# Altium project 60%KeyBord.PrjPcb
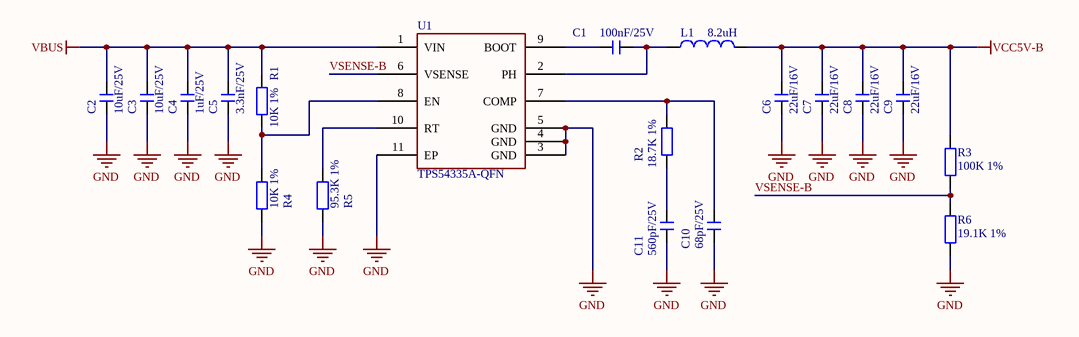
[diagram p0: PWR.SchDoc]
3 sheets, 90 parts. Net scope: global (net labels, ports and power ports of the same name join across sheets).
Board file: PCB.PcbDoc
Sheets:
  PWR.SchDoc
  mcu.SchDoc
  Connector.SchDoc

## Sheet PWR.SchDoc
size A4; SheetNumber: 1; SheetTotal: 3

### Parts
C1  100nF/25V  [C0402_L]
C2  10uF/25V  [C0603_L]
C3  10uF/25V  [C0603_L]
C4  1uF/25V  [C0603_L]
C5  3.3nF/25V  [C0603_L]
C6  22uF/16V  [C0603_L]
C7  22uF/16V  [C0603_L]
C8  22uF/16V  [C0603_L]
C9  22uF/16V  [C0603_L]
C10  68pF/25V  [C0402_L]
C11  560pF/25V  [C0402_L]
L1  8.2uH  [NR4020]
R1  10K 1%  [R0402_L]
R2  18.7K 1%  [R0402_L]
R3  100K 1%  [R0402_L]
R4  10K 1%  [R0402_L]
R5  95.3K 1%  [R0402_L]
R6  19.1K 1%  [R0402_L]
U1  TPS54335A-QFN  [VSON-10_L3.0-W3.0-P0.50-TL-EP]

### Nets
GND: C2.1 C3.1 C4.1 C5.1 C6.1 C7.1 C8.1 C9.1 C10.1 C11.1 R4.2 R5.2 R6.2 U1.3(GND) U1.4(GND) U1.5(GND) U1.11(EP)
VBUS: C2.2 C3.2 C4.2 C5.2 R1.1 U1.1(VIN)
VCC5V-B: C6.2 C7.2 C8.2 C9.2 L1.2 R3.1
VSENSE-B: R3.2 R6.1 U1.6(VSENSE)
NetC1_1: C1.1 L1.1 U1.2(PH)
NetC1_2: C1.2 U1.9(BOOT)
NetC10_2: C10.2 R2.1 U1.7(COMP)
NetC11_2: C11.2 R2.2
NetR1_2: R1.2 R4.1 U1.8(EN)
NetR5_1: R5.1 U1.10(RT)

### Library data of the parts
C1-C11 = C: 无极性贴片电容; 版权归属: 源创客; 材质: X7R; BOM名称: 无极性贴片电容; 学习资源: www.ooocke.com
L1 = L: 小功率贴片电感; 版权归属: 源创客; BOM名称: 小功率贴片电感; 学习资源: www.ooocke.com
R1-R6 = R: 贴片电阻; 版权归属: 源创客; BOM名称: 贴片电阻; 学习资源: www.ooocke.com
U1 = TPS54335A-QFN: BUCK

## Sheet mcu.SchDoc
size A4; SheetNumber: 2; SheetTotal: 3
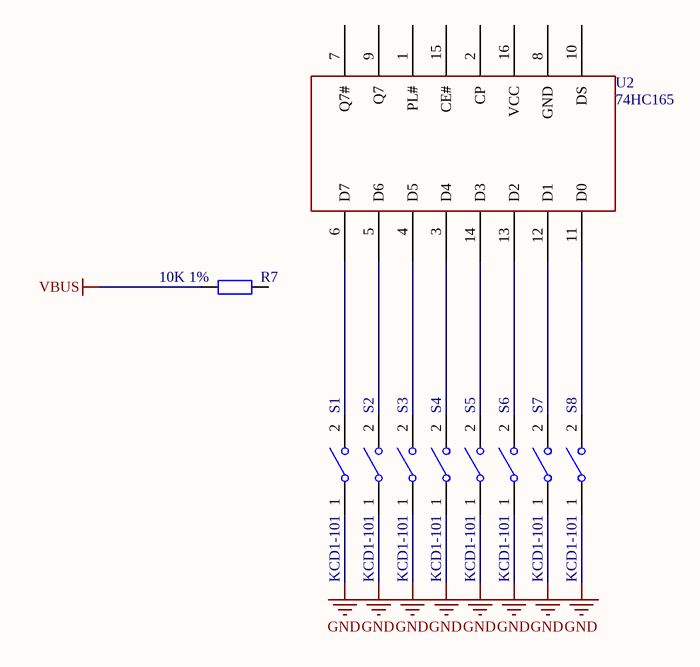
[diagram p1: mcu.SchDoc]

### Parts
R7  10K 1%  [R0402_L]
S1  KCD1-101  [KCD1-101]
S2  KCD1-101  [KCD1-101]
S3  KCD1-101  [KCD1-101]
S4  KCD1-101  [KCD1-101]
S5  KCD1-101  [KCD1-101]
S6  KCD1-101  [KCD1-101]
S7  KCD1-101  [KCD1-101]
S8  KCD1-101  [KCD1-101]
U2  74HC165  [SOP16_L]

### Nets
GND: S1.1 S2.1 S3.1 S4.1 S5.1 S6.1 S7.1 S8.1
VBUS: R7.1
NetS1_2: S1.2 U2.6(D7)
NetS2_2: S2.2 U2.5(D6)
NetS3_2: S3.2 U2.4(D5)
NetS4_2: S4.2 U2.3(D4)
NetS5_2: S5.2 U2.14(D3)
NetS6_2: S6.2 U2.13(D2)
NetS7_2: S7.2 U2.12(D1)
NetS8_2: S8.2 U2.11(D0)

Not connected (* = marked no-connect by the designer): R7 2; U2 1(PL#) 2(CP) 7(Q7#) 8(GND) 9(Q7) 10(DS) 15(CE#) 16(VCC)

### Library data of the parts
R7 = R: 贴片电阻; 版权归属: 源创客; BOM名称: 贴片电阻; 学习资源: www.ooocke.com
S1-S8 = KCD1-101: 1路单刀船型开关; 版权归属: 源创客; BOM名称: 1路单刀船型开关; 学习资源: www.ooocke.com
U2 = 74HC165: 移位寄存器

## Sheet Connector.SchDoc
size A4; SheetNumber: 3; SheetTotal: 3
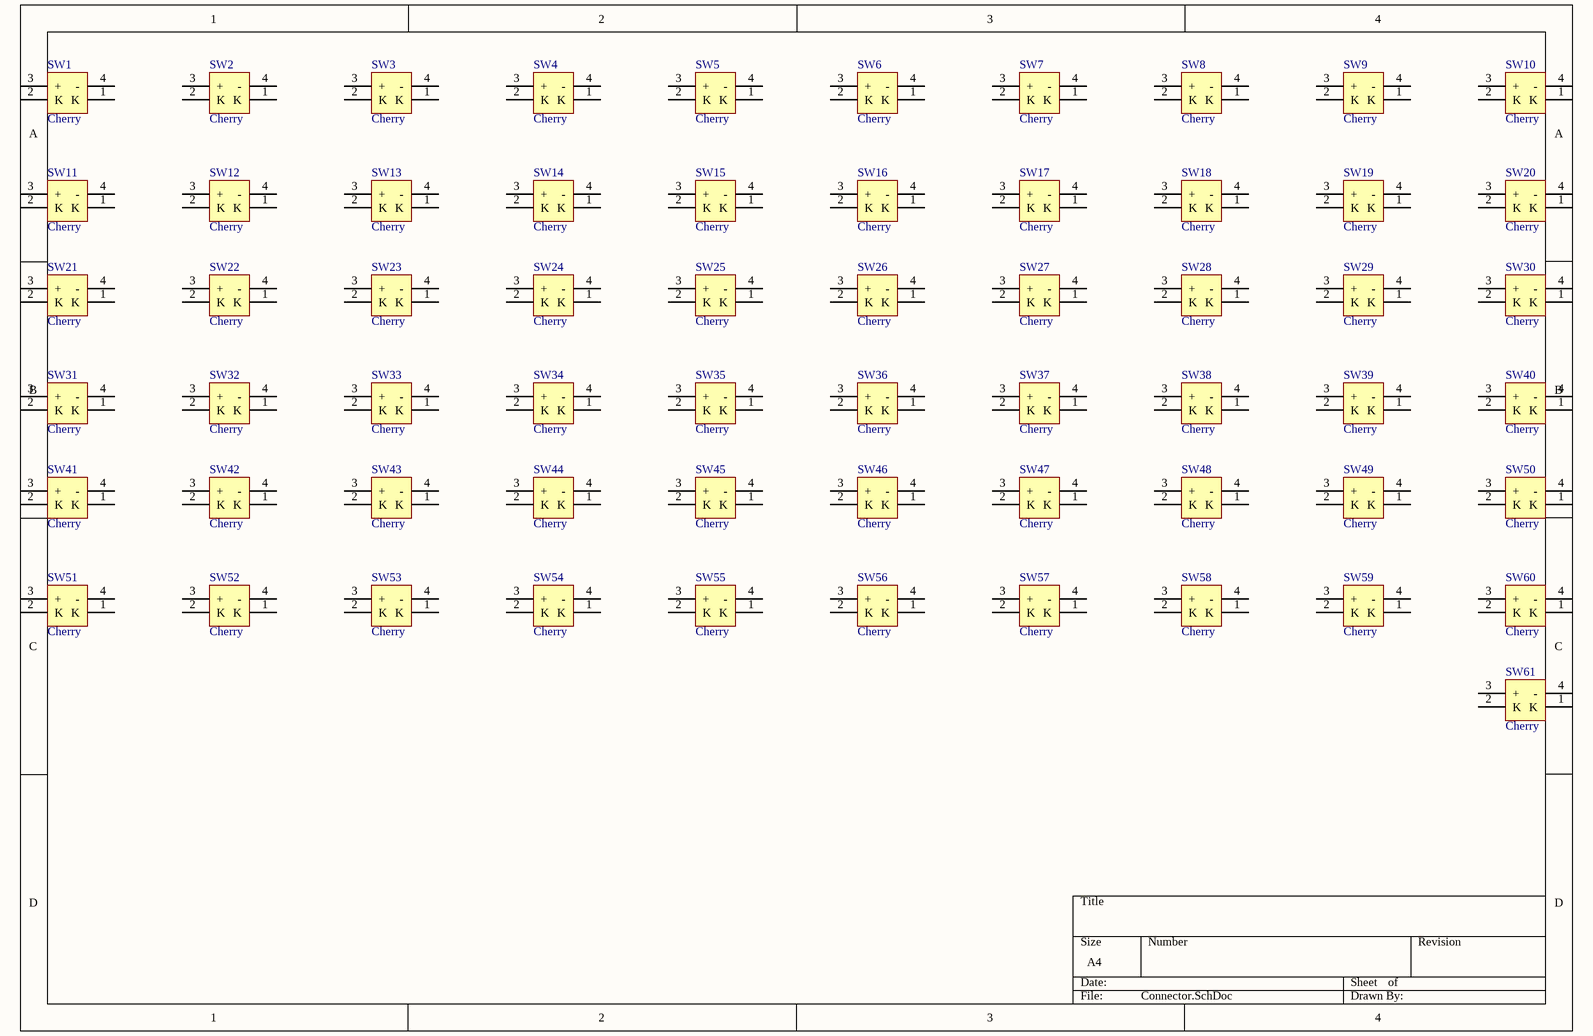
[diagram p2: Connector.SchDoc]

### Parts
SW1  Cherry  [SW_Cherry_MX_WS2812]
SW2  Cherry  [SW_Cherry_MX_WS2812]
SW3  Cherry  [SW_Cherry_MX_WS2812]
SW4  Cherry  [SW_Cherry_MX_WS2812]
SW5  Cherry  [SW_Cherry_MX_WS2812]
SW6  Cherry  [SW_Cherry_MX_WS2812]
SW7  Cherry  [SW_Cherry_MX_WS2812]
SW8  Cherry  [SW_Cherry_MX_WS2812]
SW9  Cherry  [SW_Cherry_MX_WS2812]
SW10  Cherry  [SW_Cherry_MX_WS2812]
SW11  Cherry  [SW_Cherry_MX_WS2812]
SW12  Cherry  [SW_Cherry_MX_WS2812]
SW13  Cherry  [SW_Cherry_MX_WS2812]
SW14  Cherry  [SW_Cherry_MX_WS2812]
SW15  Cherry  [SW_Cherry_MX_WS2812]
SW16  Cherry  [SW_Cherry_MX_WS2812]
SW17  Cherry  [SW_Cherry_MX_WS2812]
SW18  Cherry  [SW_Cherry_MX_WS2812]
SW19  Cherry  [SW_Cherry_MX_WS2812]
SW20  Cherry  [SW_Cherry_MX_WS2812]
SW21  Cherry  [SW_Cherry_MX_WS2812]
SW22  Cherry  [SW_Cherry_MX_WS2812]
SW23  Cherry  [SW_Cherry_MX_WS2812]
SW24  Cherry  [SW_Cherry_MX_WS2812]
SW25  Cherry  [SW_Cherry_MX_WS2812]
SW26  Cherry  [SW_Cherry_MX_WS2812]
SW27  Cherry  [SW_Cherry_MX_WS2812]
SW28  Cherry  [SW_Cherry_MX_WS2812]
SW29  Cherry  [SW_Cherry_MX_WS2812]
SW30  Cherry  [SW_Cherry_MX_WS2812]
SW31  Cherry  [SW_Cherry_MX_WS2812]
SW32  Cherry  [SW_Cherry_MX_WS2812]
SW33  Cherry  [SW_Cherry_MX_WS2812]
SW34  Cherry  [SW_Cherry_MX_WS2812]
SW35  Cherry  [SW_Cherry_MX_WS2812]
SW36  Cherry  [SW_Cherry_MX_WS2812]
SW37  Cherry  [SW_Cherry_MX_WS2812]
SW38  Cherry  [SW_Cherry_MX_WS2812]
SW39  Cherry  [SW_Cherry_MX_WS2812]
SW40  Cherry  [SW_Cherry_MX_WS2812]
SW41  Cherry  [SW_Cherry_MX_WS2812]
SW42  Cherry  [SW_Cherry_MX_WS2812]
SW43  Cherry  [SW_Cherry_MX_WS2812]
SW44  Cherry  [SW_Cherry_MX_WS2812]
SW45  Cherry  [SW_Cherry_MX_WS2812]
SW46  Cherry  [SW_Cherry_MX_WS2812]
SW47  Cherry  [SW_Cherry_MX_WS2812]
SW48  Cherry  [SW_Cherry_MX_WS2812]
SW49  Cherry  [SW_Cherry_MX_WS2812]
SW50  Cherry  [SW_Cherry_MX_WS2812]
SW51  Cherry  [SW_Cherry_MX_WS2812]
SW52  Cherry  [SW_Cherry_MX_WS2812]
SW53  Cherry  [SW_Cherry_MX_WS2812]
SW54  Cherry  [SW_Cherry_MX_WS2812]
SW55  Cherry  [SW_Cherry_MX_WS2812]
SW56  Cherry  [SW_Cherry_MX_WS2812]
SW57  Cherry  [SW_Cherry_MX_WS2812]
SW58  Cherry  [SW_Cherry_MX_WS2812]
SW59  Cherry  [SW_Cherry_MX_WS2812]
SW60  Cherry  [SW_Cherry_MX_WS2812]
SW61  Cherry  [SW_Cherry_MX_WS2812]

### Nets

Not connected (* = marked no-connect by the designer): SW1 1(K) 2(K) 3(+) 4(-); SW2 1(K) 2(K) 3(+) 4(-); SW3 1(K) 2(K) 3(+) 4(-); SW4 1(K) 2(K) 3(+) 4(-); SW5 1(K) 2(K) 3(+) 4(-); SW6 1(K) 2(K) 3(+) 4(-); SW7 1(K) 2(K) 3(+) 4(-); SW8 1(K) 2(K) 3(+) 4(-); SW9 1(K) 2(K) 3(+) 4(-); SW10 1(K) 2(K) 3(+) 4(-); SW11 1(K) 2(K) 3(+) 4(-); SW12 1(K) 2(K) 3(+) 4(-); SW13 1(K) 2(K) 3(+) 4(-); SW14 1(K) 2(K) 3(+) 4(-); SW15 1(K) 2(K) 3(+) 4(-); SW16 1(K) 2(K) 3(+) 4(-); SW17 1(K) 2(K) 3(+) 4(-); SW18 1(K) 2(K) 3(+) 4(-); SW19 1(K) 2(K) 3(+) 4(-); SW20 1(K) 2(K) 3(+) 4(-); SW21 1(K) 2(K) 3(+) 4(-); SW22 1(K) 2(K) 3(+) 4(-); SW23 1(K) 2(K) 3(+) 4(-); SW24 1(K) 2(K) 3(+) 4(-); SW25 1(K) 2(K) 3(+) 4(-); SW26 1(K) 2(K) 3(+) 4(-); SW27 1(K) 2(K) 3(+) 4(-); SW28 1(K) 2(K) 3(+) 4(-); SW29 1(K) 2(K) 3(+) 4(-); SW30 1(K) 2(K) 3(+) 4(-); SW31 1(K) 2(K) 3(+) 4(-); SW32 1(K) 2(K) 3(+) 4(-); SW33 1(K) 2(K) 3(+) 4(-); SW34 1(K) 2(K) 3(+) 4(-); SW35 1(K) 2(K) 3(+) 4(-); SW36 1(K) 2(K) 3(+) 4(-); SW37 1(K) 2(K) 3(+) 4(-); SW38 1(K) 2(K) 3(+) 4(-); SW39 1(K) 2(K) 3(+) 4(-); SW40 1(K) 2(K) 3(+) 4(-); SW41 1(K) 2(K) 3(+) 4(-); SW42 1(K) 2(K) 3(+) 4(-); SW43 1(K) 2(K) 3(+) 4(-); SW44 1(K) 2(K) 3(+) 4(-); SW45 1(K) 2(K) 3(+) 4(-); SW46 1(K) 2(K) 3(+) 4(-); SW47 1(K) 2(K) 3(+) 4(-); SW48 1(K) 2(K) 3(+) 4(-); SW49 1(K) 2(K) 3(+) 4(-); SW50 1(K) 2(K) 3(+) 4(-); SW51 1(K) 2(K) 3(+) 4(-); SW52 1(K) 2(K) 3(+) 4(-); SW53 1(K) 2(K) 3(+) 4(-); SW54 1(K) 2(K) 3(+) 4(-); SW55 1(K) 2(K) 3(+) 4(-); SW56 1(K) 2(K) 3(+) 4(-); SW57 1(K) 2(K) 3(+) 4(-); SW58 1(K) 2(K) 3(+) 4(-); SW59 1(K) 2(K) 3(+) 4(-); SW60 1(K) 2(K) 3(+) 4(-); SW61 1(K) 2(K) 3(+) 4(-)

### Library data of the parts
SW1-SW61 = LSW: 带灯机械按键开关; 版权归属: 源创客; BOM名称: 带灯机械按键开关; 学习资源: www.ooocke.com

## Nets that join several sheets
GND: PWR (17 pins), mcu (8 pins)
VBUS: PWR (6 pins), mcu (R7.1)